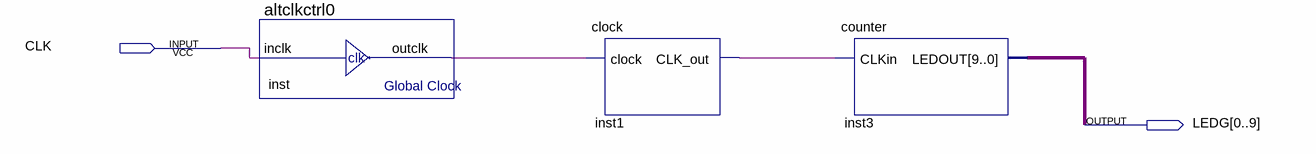
[diagram p0: schematic sheet]
// Quartus schematic blinkelights2.bdf as structural Verilog: 3 symbols, 2 pins
module blinkelights2 (
  input  CLK,
  output [0:9] LEDG
);

  wire inst1_clk_out, inst_outclk;

  altclkctrl0 inst (.inclk(CLK), .outclk(inst_outclk));
  clock inst1 (.clock(inst_outclk), .CLK_out(inst1_clk_out));
  counter inst3 (.CLKin(inst1_clk_out), .LEDOUT(LEDG));
endmodule
